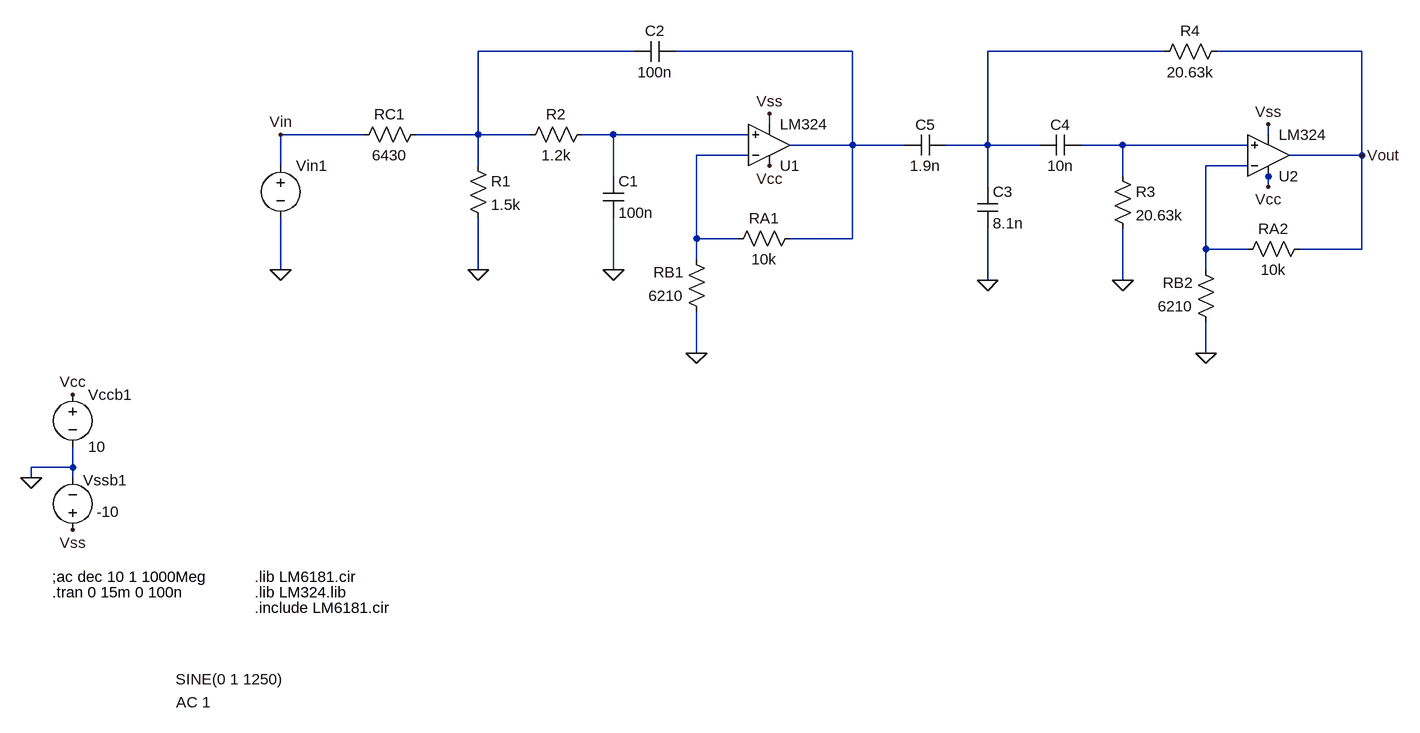
[diagram p0: schematic Draft2.asc]
Draft2.asc, the LTspice schematic file:
Version 4
SHEET 1 1148 716
WIRE -16 -304 -256 -304
WIRE 320 -304 48 -304
WIRE 800 -304 528 -304
WIRE 1104 -304 880 -304
WIRE 192 -192 192 -208
WIRE -432 -176 -560 -176
WIRE -256 -176 -256 -304
WIRE -256 -176 -352 -176
WIRE -176 -176 -256 -176
WIRE -48 -176 -96 -176
WIRE 160 -176 -48 -176
WIRE 960 -176 960 -192
WIRE 320 -160 320 -304
WIRE 320 -160 224 -160
WIRE 400 -160 320 -160
WIRE 528 -160 528 -304
WIRE 528 -160 464 -160
WIRE 608 -160 528 -160
WIRE 736 -160 672 -160
WIRE 928 -160 736 -160
WIRE 160 -144 80 -144
WIRE 1104 -144 1104 -304
WIRE 1104 -144 992 -144
WIRE -560 -128 -560 -176
WIRE -256 -128 -256 -176
WIRE 928 -128 864 -128
WIRE -48 -112 -48 -176
WIRE 736 -112 736 -160
WIRE 960 -112 960 -128
WIRE 528 -96 528 -160
WIRE 960 -96 960 -112
WIRE 80 -16 80 -144
WIRE 144 -16 80 -16
WIRE 320 -16 320 -160
WIRE 320 -16 224 -16
WIRE 864 0 864 -128
WIRE 928 0 864 0
WIRE 1104 0 1104 -144
WIRE 1104 0 1008 0
WIRE 80 16 80 -16
WIRE -560 32 -560 -48
WIRE -256 32 -256 -48
WIRE -48 32 -48 -48
WIRE 864 32 864 0
WIRE 528 48 528 -32
WIRE 736 48 736 -32
WIRE 80 160 80 96
WIRE 864 160 864 112
WIRE -880 336 -880 304
WIRE -880 336 -944 336
WIRE -944 352 -944 336
WIRE -880 352 -880 336
FLAG 192 -208 Vss
FLAG 192 -128 Vcc
FLAG -560 32 0
FLAG -944 352 0
FLAG -880 224 Vcc
FLAG -880 432 Vss
FLAG -256 32 0
FLAG -48 32 0
FLAG 80 160 0
FLAG 528 48 0
FLAG 736 48 0
FLAG 864 160 0
FLAG 1104 -144 Vout
FLAG -560 -176 Vin
FLAG 960 -192 Vss
FLAG 960 -96 Vcc
SYMBOL voltage -560 -144 R0
WINDOW 123 -161 841 Left 2
WINDOW 39 0 0 Left 0
WINDOW 3 -162 806 Left 2
SYMATTR Value2 AC 1
SYMATTR Value SINE(0 1 1250)
SYMATTR InstName Vin1
SYMBOL voltage -880 208 R0
WINDOW 123 0 0 Left 0
WINDOW 39 0 0 Left 0
SYMATTR InstName Vccb1
SYMATTR Value 10
SYMBOL voltage -880 448 R180
WINDOW 123 0 0 Left 0
WINDOW 39 0 0 Left 0
WINDOW 0 -83 92 Left 2
WINDOW 3 -72 44 Left 2
SYMATTR InstName Vssb1
SYMATTR Value -10
SYMBOL res -336 -192 R90
WINDOW 0 0 56 VBottom 2
WINDOW 3 32 56 VTop 2
SYMATTR InstName RC1
SYMATTR Value 6430
SYMBOL cap -64 -112 R0
SYMATTR InstName C1
SYMATTR Value 100n
SYMBOL cap 48 -320 R90
WINDOW 0 0 32 VBottom 2
WINDOW 3 32 32 VTop 2
SYMATTR InstName C2
SYMATTR Value 100n
SYMBOL res -272 -144 R0
SYMATTR InstName R1
SYMATTR Value 1.5k
SYMBOL res -80 -192 R90
WINDOW 0 0 56 VBottom 2
WINDOW 3 32 56 VTop 2
SYMATTR InstName R2
SYMATTR Value 1.2k
SYMBOL res 240 -32 R90
WINDOW 0 0 56 VBottom 2
WINDOW 3 32 56 VTop 2
SYMATTR InstName RA1
SYMATTR Value 10k
SYMBOL res 96 112 R180
WINDOW 0 36 76 Left 2
WINDOW 3 36 40 Left 2
SYMATTR InstName RB1
SYMATTR Value 6210
SYMBOL cap 512 -96 R0
SYMATTR InstName C3
SYMATTR Value 8.1n
SYMBOL cap 672 -176 R90
WINDOW 0 0 32 VBottom 2
WINDOW 3 32 32 VTop 2
SYMATTR InstName C4
SYMATTR Value 10n
SYMBOL res 720 -128 R0
SYMATTR InstName R3
SYMATTR Value 20.63k
SYMBOL res 896 -320 R90
WINDOW 0 0 56 VBottom 2
WINDOW 3 32 56 VTop 2
SYMATTR InstName R4
SYMATTR Value 20.63k
SYMBOL res 1024 -16 R90
WINDOW 0 0 56 VBottom 2
WINDOW 3 32 56 VTop 2
SYMATTR InstName RA2
SYMATTR Value 10k
SYMBOL res 880 128 R180
WINDOW 0 36 76 Left 2
WINDOW 3 36 40 Left 2
SYMATTR InstName RB2
SYMATTR Value 6210
SYMBOL OpAmps\\opamp2 192 -96 M180
SYMATTR InstName U1
SYMATTR Value LM324
SYMBOL OpAmps\\opamp2 960 -80 M180
SYMATTR InstName U2
SYMATTR Value LM324
SYMBOL cap 464 -176 R90
WINDOW 0 0 32 VBottom 2
WINDOW 3 32 32 VTop 2
SYMATTR InstName C5
SYMATTR Value 1.9n
TEXT -600 528 Left 2 !.lib LM324.lib
TEXT -912 504 Left 2 !;ac dec 10 1 1000Meg
TEXT -912 528 Left 2 !.tran 0 15m 0 100n
TEXT -600 504 Left 2 !.lib LM6181.cir
TEXT -600 552 Left 2 !.include LM6181.cir

The netlist it stands for:
* Draft2.asc
Vin1 Vin 0 SINE(0 1 1250) AC 1
Vccb1 Vcc 0 10
Vssb1 Vss 0 -10
RC1 N001 Vin 6430
C1 N004 0 100n
C2 N002 N001 100n
R1 N001 0 1.5k
R2 N004 N001 1.2k
RA1 N002 N006 10k
RB1 0 N006 6210
C3 N003 0 8.1n
C4 N005 N003 10n
R3 N005 0 20.63k
R4 Vout N003 20.63k
RA2 Vout N007 10k
RB2 0 N007 6210
XU1 N004 N006 Vcc Vss N002 LM324  ; pins In+ In- V+ V- OUT
XU2 N005 N007 Vcc Vss Vout LM324  ; pins In+ In- V+ V- OUT
C5 N003 N002 1.9n
.lib LM324.lib
;ac dec 10 1 1000Meg
.tran 0 15m 0 100n
.lib LM6181.cir
.include LM6181.cir
.backanno
.end